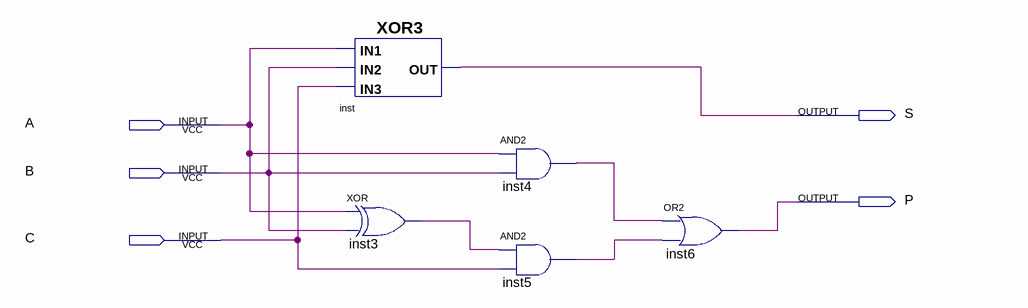
[diagram p0: schematic sheet]
// Quartus schematic Lab1v10_OPDS.bdf as structural Verilog: 5 symbols, 5 pins
module Lab1v10_OPDS (
  input  A,
  input  B,
  input  C,
  output S,
  output P
);

  wire inst3_out, inst4_out, inst5_out;

  XOR3 inst (.IN3(C), .IN1(A), .IN2(B), .OUT(S));
  xor inst3 (inst3_out, A, B);
  and inst4 (inst4_out, A, B);
  and inst5 (inst5_out, inst3_out, C);
  or inst6 (P, inst4_out, inst5_out);
endmodule
